# Altium project BATTERY_BOARD_K6T6.PrjPCB
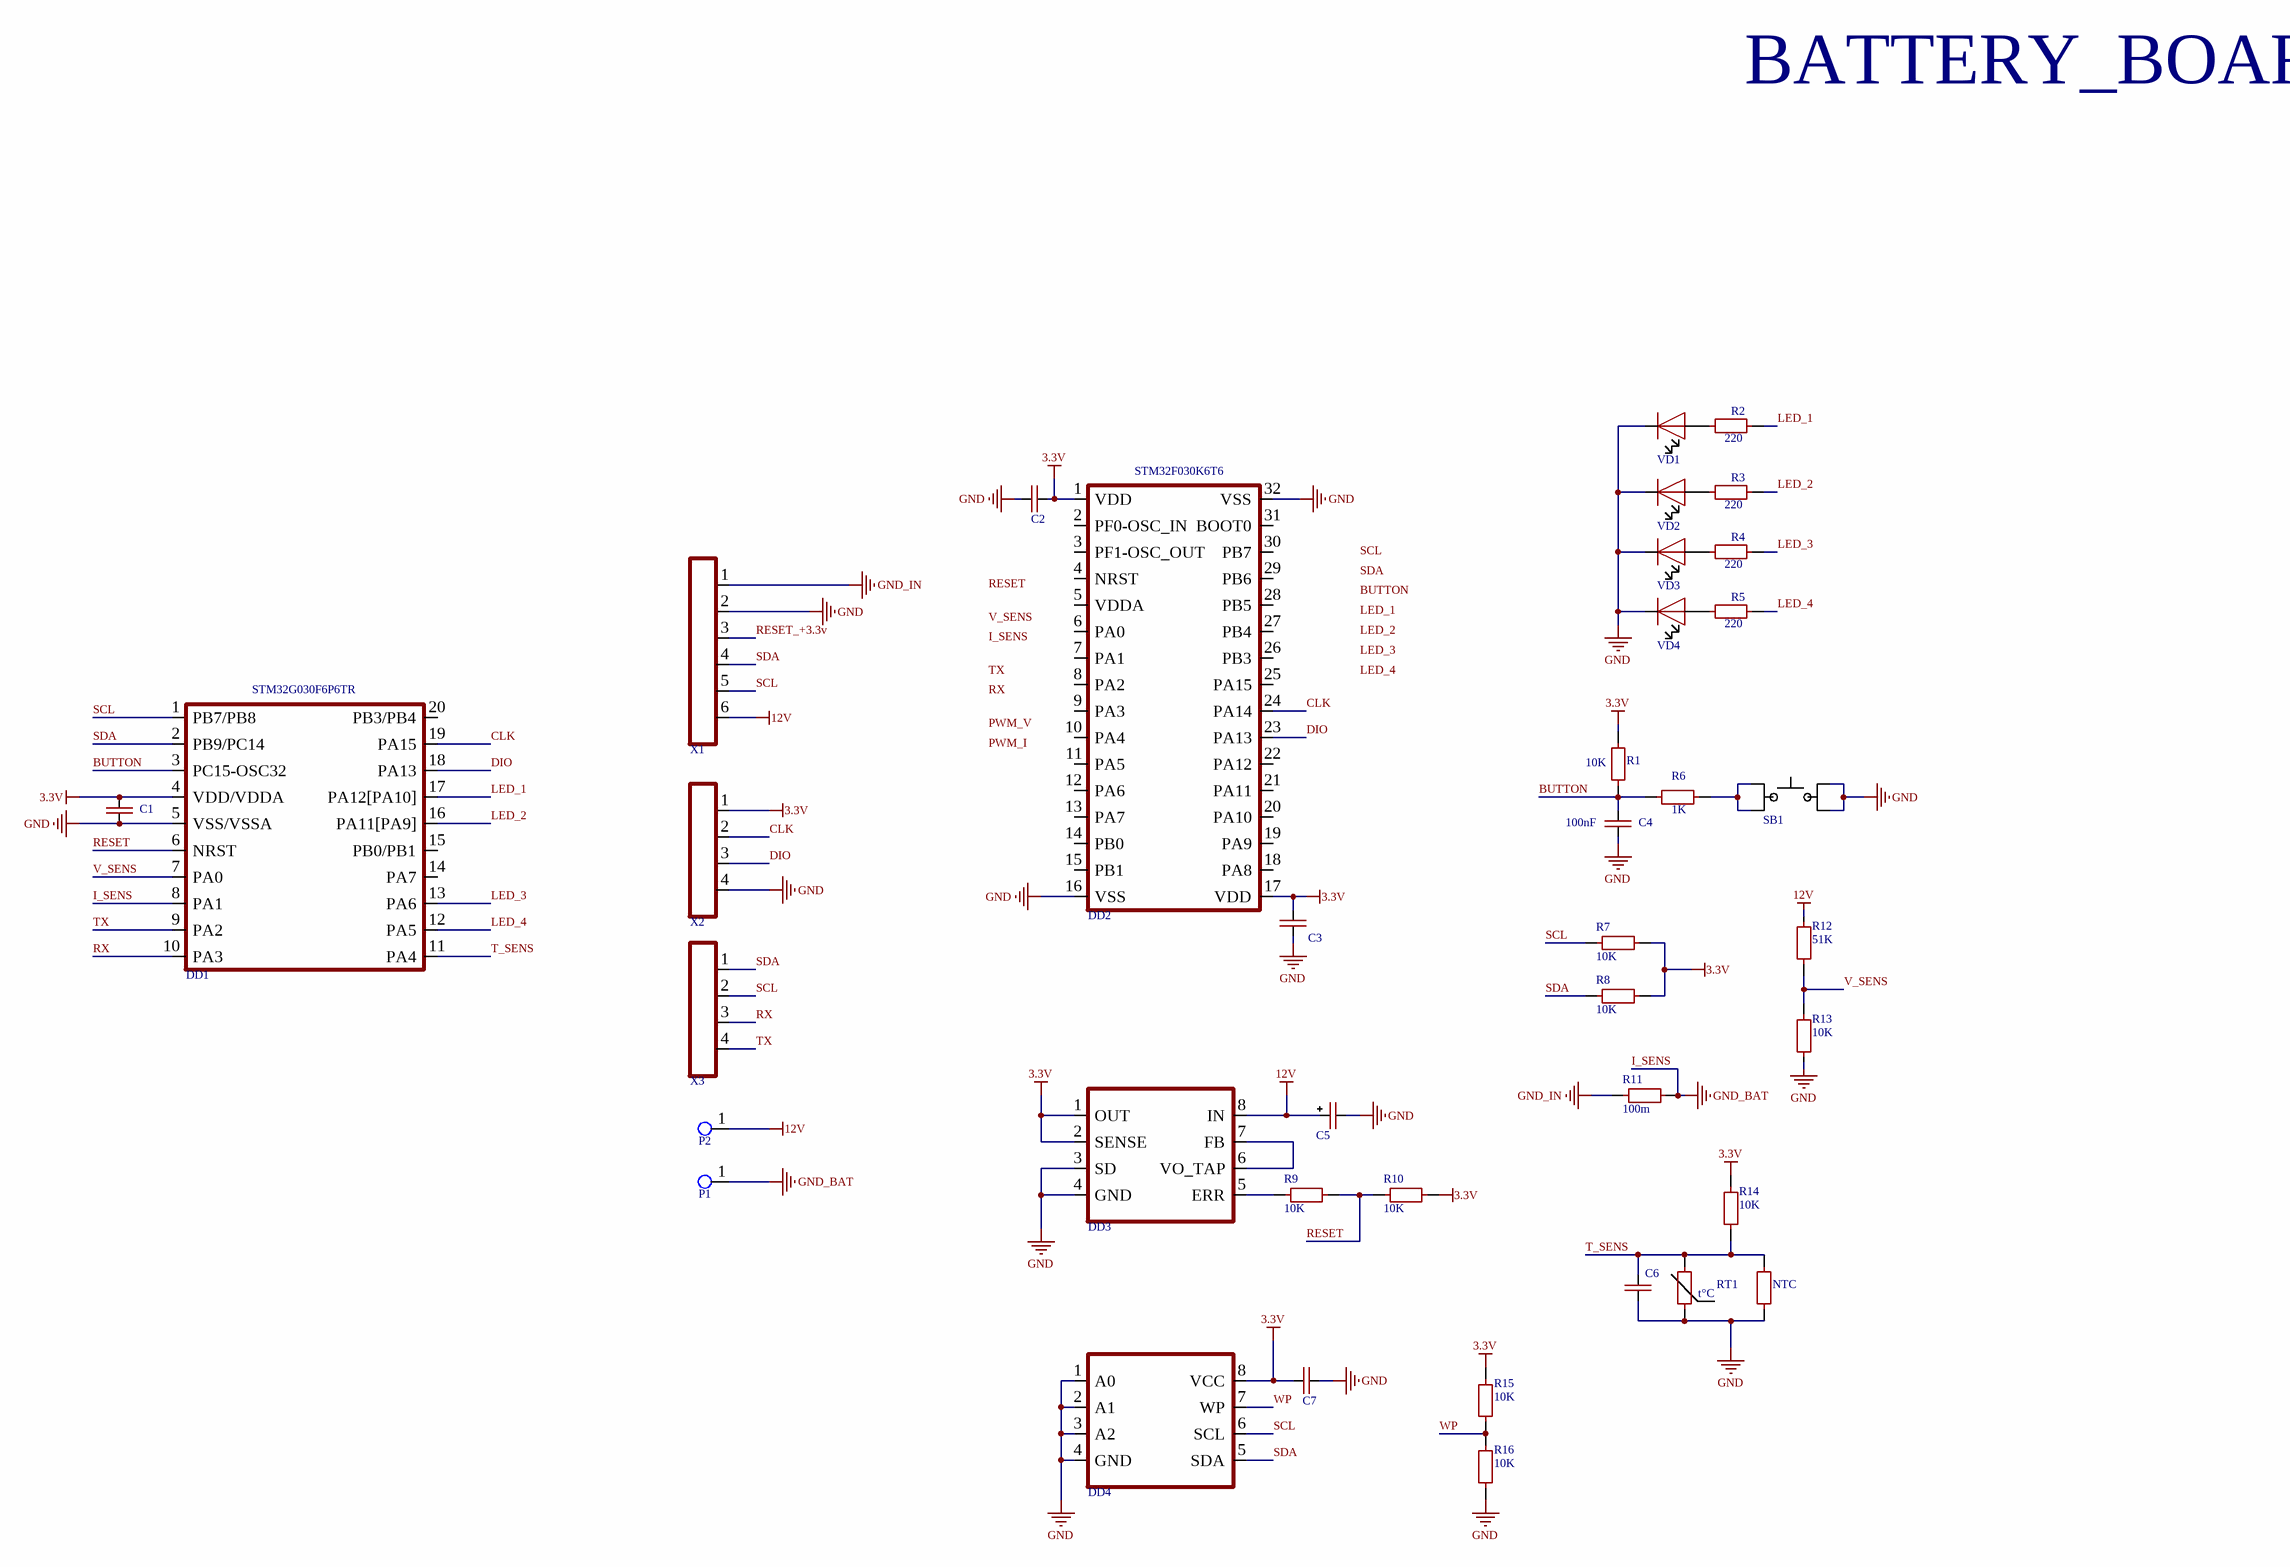
[diagram p0: BATTERY_BOARD_K6T6.SchDoc]
1 sheet, 39 parts. Net scope: global (net labels, ports and power ports of the same name join across sheets).
Board file: BATTERY_BOARD_K6T6.PcbDoc

## Sheet BATTERY_BOARD_K6T6.SchDoc
size A1

### Parts
C1  CAP-NON-POLAR  [CAP-0603]  (value not drawn)
C2  CAP-NON-POLAR  [CAP-0603]  (value not drawn)
C3  CAP-NON-POLAR  [CAP-0603]  (value not drawn)
C4  100nF  [CAP-0603]
C5  CAP-POLAR  [CAP-TAN-C]  (value not drawn)
C6  CAP-NON-POLAR  [CAP-0805]  (value not drawn)
C7  CAP-NON-POLAR  [CAP-0603]  (value not drawn)
DD1  STM32G030F6P6TR  [TSSOP-20]
DD2  STM32F030K6T6  [LQFP32]
DD3  LP2951  [SO8-150]  (value not drawn)
DD4  24C256  [SO8-150]  (value not drawn)
NTC  RES-CONST  [RES-0805]  (value not drawn)
P1  Test_Point_PCB  [Point]  (value not drawn)
P2  Test_Point_PCB  [Point]  (value not drawn)
R1  10K  [RES-0603]
R2  220  [RES-0603]
R3  220  [RES-0603]
R4  220  [RES-0603]
R5  220  [RES-0603]
R6  1K  [RES-0603]
R7  10K  [RES-0603]
R8  10K  [RES-0603]
R9  10K  [RES-0603]
R10  10K  [RES-0603]
R11  100m  [RES-2512]
R12  51K  [RES-0603]
R13  10K  [RES-0603]
R14  10K  [RES-0603]
R15  10K  [RES-0603]
R16  10K  [RES-0603]
RT1  RES-TEMP  [NTC_MF52]  (value not drawn)
SB1  BUTTON-TACT-4PIN  [TACTB-6x6 SMD]  (value not drawn)
VD1  LED  [LED-0603]  (value not drawn)
VD2  LED  [LED-0603]  (value not drawn)
VD3  LED  [LED-0603]  (value not drawn)
VD4  LED  [LED-0603]  (value not drawn)
X1  CONN-6-PIN  [CON_6PIN_BATT_DEFIBRILLATOR]  (value not drawn)
X2  CONN-4-PIN  [CONN-PLS-4-2.54mm]  (value not drawn)
X3  CONN-4-PIN  [CONN-PLS-4-2.54mm]  (value not drawn)

### Nets
3.3V: C1.2 C2.2 C3.2 C7.2 DD1.4(VDD/VDDA) DD2.1(VDD) DD2.17(VDD) DD3.1(OUT) DD3.2(SENSE) DD4.8(VCC) R1.2 R7.1 R8.1 R10.1 R14.1 R15.1 X2.1
12V: C5.1(+) DD3.8(IN) P2.1(G9) R12.1 X1.6
GND: C1.1 C2.1 C3.1 C4.1 C5.2(-) C6.1 C7.1 DD1.5(VSS/VSSA) DD2.16(VSS) DD2.32(VSS) DD3.3(SD) DD3.4(GND) DD4.1(A0) DD4.2(A1) DD4.3(A2) DD4.4(GND) NTC.1 R13.2 R16.2 RT1.1 SB1.3 SB1.4 VD1.1(C) VD2.1(C) VD3.1(C) VD4.1(C) X1.2 X2.4
GND_IN: R11.1 X1.1
I_SENS: DD1.8(PA1) P1.1(G9) R11.2  [also labelled GND_BAT]
BUTTON: C4.2 DD1.3(PC15-OSC32) R1.1 R6.1
CLK: DD1.19(PA15) DD2.24(PA14) X2.2
DIO: DD1.18(PA13) DD2.23(PA13) X2.3
LED_1: DD1.17(PA12[PA10]) R2.2
LED_2: DD1.16(PA11[PA9]) R3.2
LED_3: DD1.13(PA6) R4.2
LED_4: DD1.12(PA5) R5.2
RESET: DD1.6(NRST) R9.1 R10.2
RESET_+3.3v: X1.3
RX: DD1.10(PA3) X3.3
SCL: DD1.1(PB7/PB8) DD4.6(SCL) R7.2 X1.5 X3.2
SDA: DD1.2(PB9/PC14) DD4.5(SDA) R8.2 X1.4 X3.1
T_SENS: C6.2 DD1.11(PA4) NTC.2 R14.2 RT1.2
TX: DD1.9(PA2) X3.4
V_SENS: DD1.7(PA0) R12.2 R13.1
WP: DD4.7(WP) R15.2 R16.1
NetDD3_5: DD3.5(ERR) R9.2
NetDD3_6: DD3.6(VO_TAP) DD3.7(FB)
NetR2_1: R2.1 VD1.2(A)
NetR3_1: R3.1 VD2.2(A)
NetR4_1: R4.1 VD3.2(A)
NetR5_1: R5.1 VD4.2(A)
NetR6_2: R6.2 SB1.1 SB1.2

Not connected (* = marked no-connect by the designer): DD1 14(PA7) 15(PB0/PB1) 20(PB3/PB4); DD2 2(PF0-OSC_IN) 3(PF1-OSC_OUT) 4(NRST) 5(VDDA) 6(PA0) 7(PA1) 8(PA2) 9(PA3) 10(PA4) 11(PA5) 12(PA6) 13(PA7) 14(PB0) 15(PB1) 18(PA8) 19(PA9) 20(PA10) 21(PA11) 22(PA12) 25(PA15) 26(PB3) 27(PB4) 28(PB5) 29(PB6) 30(PB7) 31(BOOT0)

### Notes on the sheet
- BATTERY_BOARD
- Labels drawn without touching a wire or pin: BUTTON, I_SENS, LED_1, LED_2, LED_3, LED_4, PWM_I, PWM_V, RESET, RX, SCL, SDA, TX, V_SENS
- (in symbol RES-TEMP) t°C

### Library data of the parts
C4 = CAP-NON-POLAR
P1 P2 = POINT
R1-R16 = RES-CONST